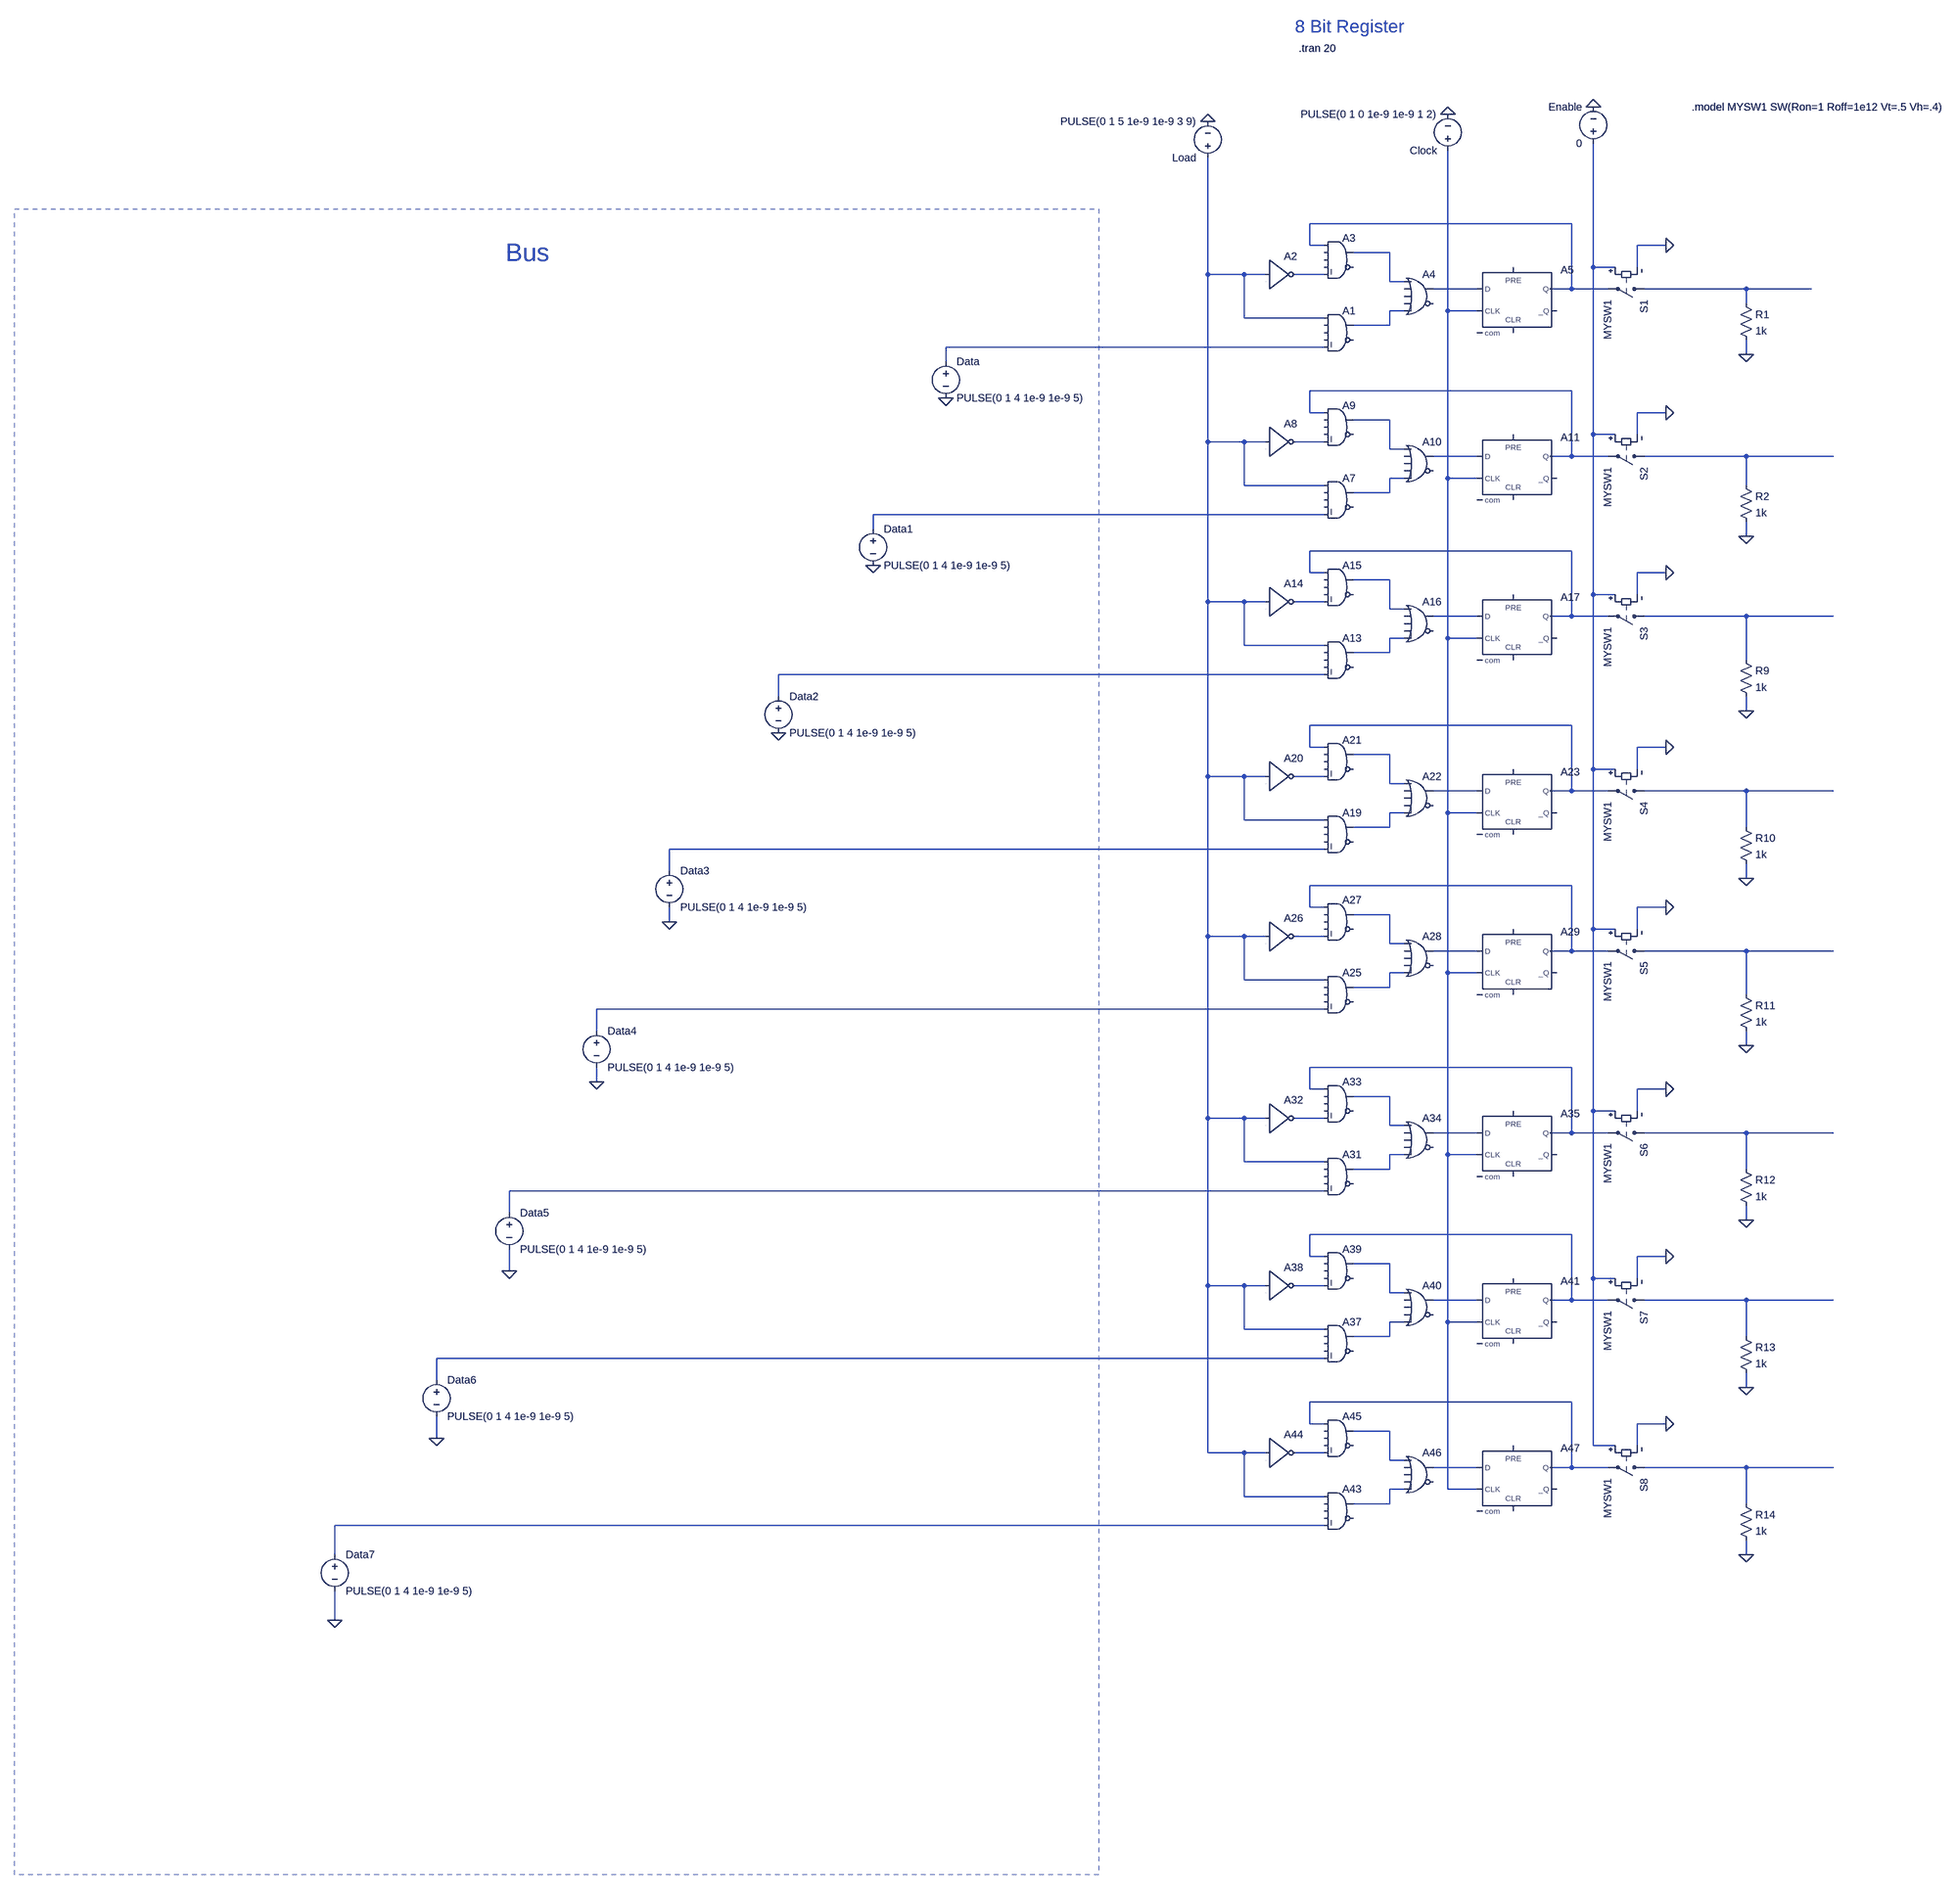
[diagram p0: schematic 8 Bit Register.asc]
8 Bit Register.asc, the LTspice schematic file:
Version 4
SHEET 1 3200 3668
WIRE 976 -176 400 -176
WIRE 400 -128 400 -176
WIRE 432 -128 400 -128
WIRE 1184 -128 1120 -128
WIRE 576 -112 496 -112
WIRE 1024 -80 1024 -576
WIRE 1072 -80 1024 -80
WIRE 1120 -80 1120 -128
WIRE 176 -64 176 -544
WIRE 256 -64 176 -64
WIRE 304 -64 256 -64
WIRE 432 -64 368 -64
WIRE 576 -48 576 -112
WIRE 608 -48 576 -48
WIRE 768 -32 672 -32
WIRE 976 -32 976 -176
WIRE 976 -32 928 -32
WIRE 1056 -32 976 -32
WIRE 1360 -32 1136 -32
WIRE 1504 -32 1360 -32
WIRE 1360 0 1360 -32
WIRE 608 16 576 16
WIRE 704 16 704 -560
WIRE 768 16 704 16
WIRE 256 32 256 -64
WIRE 432 32 256 32
WIRE 576 48 576 16
WIRE 576 48 496 48
WIRE 432 96 -400 96
WIRE 1360 112 1360 80
WIRE -400 128 -400 96
WIRE 976 192 400 192
WIRE 400 240 400 192
WIRE 432 240 400 240
WIRE 1184 240 1120 240
WIRE 576 256 496 256
WIRE 1024 288 1024 -80
WIRE 1072 288 1024 288
WIRE 1120 288 1120 240
WIRE 176 304 176 -64
WIRE 256 304 176 304
WIRE 304 304 256 304
WIRE 432 304 368 304
WIRE 576 320 576 256
WIRE 608 320 576 320
WIRE 768 336 672 336
WIRE 976 336 976 192
WIRE 976 336 928 336
WIRE 1056 336 976 336
WIRE 1360 336 1136 336
WIRE 1552 336 1360 336
WIRE 608 384 576 384
WIRE 704 384 704 16
WIRE 768 384 704 384
WIRE 256 400 256 304
WIRE 432 400 256 400
WIRE 1360 400 1360 336
WIRE 576 416 576 384
WIRE 576 416 496 416
WIRE 432 464 -560 464
WIRE -560 496 -560 464
WIRE 1360 512 1360 480
WIRE 976 544 400 544
WIRE 400 592 400 544
WIRE 432 592 400 592
WIRE 1184 592 1120 592
WIRE 576 608 496 608
WIRE 1024 640 1024 288
WIRE 1072 640 1024 640
WIRE 1120 640 1120 592
WIRE 176 656 176 304
WIRE 256 656 176 656
WIRE 304 656 256 656
WIRE 432 656 368 656
WIRE 576 672 576 608
WIRE 608 672 576 672
WIRE 768 688 672 688
WIRE 976 688 976 544
WIRE 976 688 928 688
WIRE 1056 688 976 688
WIRE 1360 688 1136 688
WIRE 1552 688 1360 688
WIRE 608 736 576 736
WIRE 704 736 704 384
WIRE 768 736 704 736
WIRE 256 752 256 656
WIRE 432 752 256 752
WIRE 576 768 576 736
WIRE 576 768 496 768
WIRE 1360 784 1360 688
WIRE 432 816 -768 816
WIRE -768 864 -768 816
WIRE 1360 896 1360 864
WIRE 976 928 400 928
WIRE 400 976 400 928
WIRE 432 976 400 976
WIRE 1184 976 1120 976
WIRE 576 992 496 992
WIRE 1024 1024 1024 640
WIRE 1072 1024 1024 1024
WIRE 1120 1024 1120 976
WIRE 176 1040 176 656
WIRE 256 1040 176 1040
WIRE 304 1040 256 1040
WIRE 432 1040 368 1040
WIRE 576 1056 576 992
WIRE 608 1056 576 1056
WIRE 768 1072 672 1072
WIRE 976 1072 976 928
WIRE 976 1072 928 1072
WIRE 1056 1072 976 1072
WIRE 1360 1072 1136 1072
WIRE 1552 1072 1360 1072
WIRE 608 1120 576 1120
WIRE 704 1120 704 736
WIRE 768 1120 704 1120
WIRE 256 1136 256 1040
WIRE 432 1136 256 1136
WIRE 576 1152 576 1120
WIRE 576 1152 496 1152
WIRE 1360 1152 1360 1072
WIRE 432 1200 -1008 1200
WIRE -1008 1248 -1008 1200
WIRE 1360 1264 1360 1232
WIRE 976 1280 400 1280
WIRE 400 1328 400 1280
WIRE 432 1328 400 1328
WIRE 1184 1328 1120 1328
WIRE 576 1344 496 1344
WIRE -1008 1360 -1008 1328
WIRE 1024 1376 1024 1024
WIRE 1072 1376 1024 1376
WIRE 1120 1376 1120 1328
WIRE 176 1392 176 1040
WIRE 256 1392 176 1392
WIRE 304 1392 256 1392
WIRE 432 1392 368 1392
WIRE 576 1408 576 1344
WIRE 608 1408 576 1408
WIRE 768 1424 672 1424
WIRE 976 1424 976 1280
WIRE 976 1424 928 1424
WIRE 1056 1424 976 1424
WIRE 1360 1424 1136 1424
WIRE 1552 1424 1360 1424
WIRE 608 1472 576 1472
WIRE 704 1472 704 1120
WIRE 768 1472 704 1472
WIRE 256 1488 256 1392
WIRE 432 1488 256 1488
WIRE 576 1504 576 1472
WIRE 576 1504 496 1504
WIRE 1360 1520 1360 1424
WIRE 432 1552 -1168 1552
WIRE -1168 1600 -1168 1552
WIRE 1360 1632 1360 1600
WIRE 976 1680 400 1680
WIRE -1168 1712 -1168 1680
WIRE 400 1728 400 1680
WIRE 432 1728 400 1728
WIRE 1184 1728 1120 1728
WIRE 576 1744 496 1744
WIRE 1024 1776 1024 1376
WIRE 1072 1776 1024 1776
WIRE 1120 1776 1120 1728
WIRE 176 1792 176 1392
WIRE 256 1792 176 1792
WIRE 304 1792 256 1792
WIRE 432 1792 368 1792
WIRE 576 1808 576 1744
WIRE 608 1808 576 1808
WIRE 768 1824 672 1824
WIRE 976 1824 976 1680
WIRE 976 1824 928 1824
WIRE 1056 1824 976 1824
WIRE 1360 1824 1136 1824
WIRE 1552 1824 1360 1824
WIRE 608 1872 576 1872
WIRE 704 1872 704 1472
WIRE 768 1872 704 1872
WIRE 256 1888 256 1792
WIRE 432 1888 256 1888
WIRE 576 1904 576 1872
WIRE 576 1904 496 1904
WIRE 1360 1904 1360 1824
WIRE 432 1952 -1360 1952
WIRE -1360 2000 -1360 1952
WIRE 1360 2016 1360 1984
WIRE 976 2048 400 2048
WIRE 400 2096 400 2048
WIRE 432 2096 400 2096
WIRE 1184 2096 1120 2096
WIRE 576 2112 496 2112
WIRE -1360 2128 -1360 2080
WIRE 1024 2144 1024 1776
WIRE 1072 2144 1024 2144
WIRE 1120 2144 1120 2096
WIRE 176 2160 176 1792
WIRE 256 2160 176 2160
WIRE 304 2160 256 2160
WIRE 432 2160 368 2160
WIRE 576 2176 576 2112
WIRE 608 2176 576 2176
WIRE 768 2192 672 2192
WIRE 976 2192 976 2048
WIRE 976 2192 928 2192
WIRE 1056 2192 976 2192
WIRE 1360 2192 1136 2192
WIRE 1552 2192 1360 2192
WIRE 608 2240 576 2240
WIRE 704 2240 704 1872
WIRE 768 2240 704 2240
WIRE 256 2256 256 2160
WIRE 432 2256 256 2256
WIRE 576 2272 576 2240
WIRE 576 2272 496 2272
WIRE 1360 2272 1360 2192
WIRE 432 2320 -1520 2320
WIRE -1520 2368 -1520 2320
WIRE 1360 2384 1360 2352
WIRE 976 2416 400 2416
WIRE 400 2464 400 2416
WIRE 432 2464 400 2464
WIRE 1184 2464 1120 2464
WIRE 576 2480 496 2480
WIRE -1520 2496 -1520 2448
WIRE 1024 2512 1024 2144
WIRE 1072 2512 1024 2512
WIRE 1120 2512 1120 2464
WIRE 176 2528 176 2160
WIRE 256 2528 176 2528
WIRE 304 2528 256 2528
WIRE 432 2528 368 2528
WIRE 576 2544 576 2480
WIRE 608 2544 576 2544
WIRE 768 2560 672 2560
WIRE 976 2560 976 2416
WIRE 976 2560 928 2560
WIRE 1056 2560 976 2560
WIRE 1360 2560 1136 2560
WIRE 1552 2560 1360 2560
WIRE 608 2608 576 2608
WIRE 704 2608 704 2240
WIRE 768 2608 704 2608
WIRE 256 2624 256 2528
WIRE 432 2624 256 2624
WIRE 576 2640 576 2608
WIRE 576 2640 496 2640
WIRE 1360 2640 1360 2560
WIRE 432 2688 -1744 2688
WIRE -1744 2752 -1744 2688
WIRE 1360 2752 1360 2720
WIRE -1744 2896 -1744 2832
FLAG -400 208 0
FLAG 704 -640 0
FLAG 176 -624 0
FLAG -560 576 0
FLAG -768 944 0
FLAG -1008 1360 0
FLAG -1168 1712 0
FLAG -1360 2128 0
FLAG -1520 2496 0
FLAG -1744 2896 0
FLAG 1184 -128 0
FLAG 1024 -656 0
FLAG 1184 240 0
FLAG 1184 592 0
FLAG 1184 976 0
FLAG 1184 1328 0
FLAG 1184 1728 0
FLAG 1184 2096 0
FLAG 1184 2464 0
FLAG 1360 112 0
FLAG 1360 512 0
FLAG 1360 896 0
FLAG 1360 1264 0
FLAG 1360 1632 0
FLAG 1360 2016 0
FLAG 1360 2384 0
FLAG 1360 2752 0
SYMBOL voltage -400 112 R0
WINDOW 123 0 0 Left 0
WINDOW 39 0 0 Left 0
SYMATTR InstName Data
SYMATTR Value PULSE(0 1 4 1e-9 1e-9 5)
SYMBOL voltage 176 -528 R180
WINDOW 123 0 0 Left 0
WINDOW 39 0 0 Left 0
SYMATTR InstName Load
SYMATTR Value PULSE(0 1 5 1e-9 1e-9 3 9)
SYMBOL Digital\\and 464 0 R0
SYMATTR InstName A1
SYMBOL Digital\\inv 304 -128 R0
SYMATTR InstName A2
SYMBOL Digital\\and 464 -160 R0
SYMATTR InstName A3
SYMBOL Digital\\or 640 -80 R0
SYMATTR InstName A4
SYMBOL Digital\\dflop 848 -80 R0
SYMATTR InstName A5
SYMBOL voltage 704 -544 R180
WINDOW 123 0 0 Left 0
WINDOW 39 0 0 Left 0
SYMATTR InstName Clock
SYMATTR Value PULSE(0 1 0 1e-9 1e-9 1 2)
SYMBOL Digital\\and 464 368 R0
SYMATTR InstName A7
SYMBOL Digital\\inv 304 240 R0
SYMATTR InstName A8
SYMBOL Digital\\and 464 208 R0
SYMATTR InstName A9
SYMBOL Digital\\or 640 288 R0
SYMATTR InstName A10
SYMBOL Digital\\dflop 848 288 R0
SYMATTR InstName A11
SYMBOL Digital\\and 464 720 R0
SYMATTR InstName A13
SYMBOL Digital\\inv 304 592 R0
SYMATTR InstName A14
SYMBOL Digital\\and 464 560 R0
SYMATTR InstName A15
SYMBOL Digital\\or 640 640 R0
SYMATTR InstName A16
SYMBOL Digital\\dflop 848 640 R0
SYMATTR InstName A17
SYMBOL Digital\\and 464 1104 R0
SYMATTR InstName A19
SYMBOL Digital\\inv 304 976 R0
SYMATTR InstName A20
SYMBOL Digital\\and 464 944 R0
SYMATTR InstName A21
SYMBOL Digital\\or 640 1024 R0
SYMATTR InstName A22
SYMBOL Digital\\dflop 848 1024 R0
SYMATTR InstName A23
SYMBOL Digital\\and 464 1456 R0
SYMATTR InstName A25
SYMBOL Digital\\inv 304 1328 R0
SYMATTR InstName A26
SYMBOL Digital\\and 464 1296 R0
SYMATTR InstName A27
SYMBOL Digital\\or 640 1376 R0
SYMATTR InstName A28
SYMBOL Digital\\dflop 848 1376 R0
SYMATTR InstName A29
SYMBOL Digital\\and 464 1856 R0
SYMATTR InstName A31
SYMBOL Digital\\inv 304 1728 R0
SYMATTR InstName A32
SYMBOL Digital\\and 464 1696 R0
SYMATTR InstName A33
SYMBOL Digital\\or 640 1776 R0
SYMATTR InstName A34
SYMBOL Digital\\dflop 848 1776 R0
SYMATTR InstName A35
SYMBOL Digital\\and 464 2224 R0
SYMATTR InstName A37
SYMBOL Digital\\inv 304 2096 R0
SYMATTR InstName A38
SYMBOL Digital\\and 464 2064 R0
SYMATTR InstName A39
SYMBOL Digital\\or 640 2144 R0
SYMATTR InstName A40
SYMBOL Digital\\dflop 848 2144 R0
SYMATTR InstName A41
SYMBOL Digital\\and 464 2592 R0
SYMATTR InstName A43
SYMBOL Digital\\inv 304 2464 R0
SYMATTR InstName A44
SYMBOL Digital\\and 464 2432 R0
SYMATTR InstName A45
SYMBOL Digital\\or 640 2512 R0
SYMATTR InstName A46
SYMBOL Digital\\dflop 848 2512 R0
SYMATTR InstName A47
SYMBOL voltage -560 480 R0
WINDOW 123 0 0 Left 0
WINDOW 39 0 0 Left 0
SYMATTR InstName Data1
SYMATTR Value PULSE(0 1 4 1e-9 1e-9 5)
SYMBOL voltage -768 848 R0
WINDOW 123 0 0 Left 0
WINDOW 39 0 0 Left 0
SYMATTR InstName Data2
SYMATTR Value PULSE(0 1 4 1e-9 1e-9 5)
SYMBOL voltage -1008 1232 R0
WINDOW 123 0 0 Left 0
WINDOW 39 0 0 Left 0
SYMATTR InstName Data3
SYMATTR Value PULSE(0 1 4 1e-9 1e-9 5)
SYMBOL voltage -1168 1584 R0
WINDOW 123 0 0 Left 0
WINDOW 39 0 0 Left 0
SYMATTR InstName Data4
SYMATTR Value PULSE(0 1 4 1e-9 1e-9 5)
SYMBOL voltage -1360 1984 R0
WINDOW 123 0 0 Left 0
WINDOW 39 0 0 Left 0
SYMATTR InstName Data5
SYMATTR Value PULSE(0 1 4 1e-9 1e-9 5)
SYMBOL voltage -1520 2352 R0
WINDOW 123 0 0 Left 0
WINDOW 39 0 0 Left 0
SYMATTR InstName Data6
SYMATTR Value PULSE(0 1 4 1e-9 1e-9 5)
SYMBOL voltage -1744 2736 R0
WINDOW 123 0 0 Left 0
WINDOW 39 0 0 Left 0
SYMATTR InstName Data7
SYMATTR Value PULSE(0 1 4 1e-9 1e-9 5)
SYMBOL voltage 1024 -560 R180
WINDOW 0 24 96 Left 2
WINDOW 3 24 16 Left 2
WINDOW 123 0 0 Left 0
WINDOW 39 0 0 Left 0
SYMATTR InstName Enable
SYMATTR Value 0
SYMBOL sw 1152 -32 R90
SYMATTR InstName S1
SYMATTR Value MYSW1
SYMBOL res 1344 -16 R0
SYMATTR InstName R1
SYMATTR Value 1k
SYMBOL sw 1152 336 R90
SYMATTR InstName S2
SYMATTR Value MYSW1
SYMBOL sw 1152 688 R90
SYMATTR InstName S3
SYMATTR Value MYSW1
SYMBOL sw 1152 1072 R90
SYMATTR InstName S4
SYMATTR Value MYSW1
SYMBOL sw 1152 1424 R90
SYMATTR InstName S5
SYMATTR Value MYSW1
SYMBOL sw 1152 1824 R90
SYMATTR InstName S6
SYMATTR Value MYSW1
SYMBOL sw 1152 2192 R90
SYMATTR InstName S7
SYMATTR Value MYSW1
SYMBOL sw 1152 2560 R90
SYMATTR InstName S8
SYMATTR Value MYSW1
SYMBOL res 1344 384 R0
SYMATTR InstName R2
SYMATTR Value 1k
SYMBOL res 1344 768 R0
SYMATTR InstName R9
SYMATTR Value 1k
SYMBOL res 1344 1136 R0
SYMATTR InstName R10
SYMATTR Value 1k
SYMBOL res 1344 1504 R0
SYMATTR InstName R11
SYMATTR Value 1k
SYMBOL res 1344 1888 R0
SYMATTR InstName R12
SYMATTR Value 1k
SYMBOL res 1344 2256 R0
SYMATTR InstName R13
SYMATTR Value 1k
SYMBOL res 1344 2624 R0
SYMATTR InstName R14
SYMATTR Value 1k
TEXT 376 -840 Left 2 !.tran 20
TEXT 368 -888 Left 4 ;8 Bit Register
TEXT -1368 -112 Left 5 ;Bus
TEXT 1240 -656 Left 2 !.model MYSW1 SW(Ron=1 Roff=1e12 Vt=.5 Vh=.4)
RECTANGLE Normal -64 3456 -2448 -208 1

The netlist it stands for:
* 8 Bit Register.asc
V§Data N010 0 PULSE(0 1 4 1e-9 1e-9 5)
V§Load N004 0 PULSE(0 1 5 1e-9 1e-9 3 9)
A1 N004 0 0 0 N010 0 N008 0 AND
A2 N004 0 0 0 0 N005 0 0 BUF
A3 N001 0 0 0 N005 0 N002 0 AND
A4 N002 0 0 0 N008 0 N006 0 OR
A5 N006 0 N009 0 0 0 N001 0 DFLOP
V§Clock N009 0 PULSE(0 1 0 1e-9 1e-9 1 2)
A7 N004 0 0 0 N017 0 N016 0 AND
A8 N004 0 0 0 0 N013 0 0 BUF
A9 N011 0 0 0 N013 0 N012 0 AND
A10 N012 0 0 0 N016 0 N014 0 OR
A11 N014 0 N009 0 0 0 N011 0 DFLOP
A13 N004 0 0 0 N024 0 N023 0 AND
A14 N004 0 0 0 0 N020 0 0 BUF
A15 N018 0 0 0 N020 0 N019 0 AND
A16 N019 0 0 0 N023 0 N021 0 OR
A17 N021 0 N009 0 0 0 N018 0 DFLOP
A19 N004 0 0 0 N031 0 N030 0 AND
A20 N004 0 0 0 0 N027 0 0 BUF
A21 N025 0 0 0 N027 0 N026 0 AND
A22 N026 0 0 0 N030 0 N028 0 OR
A23 N028 0 N009 0 0 0 N025 0 DFLOP
A25 N004 0 0 0 N038 0 N037 0 AND
A26 N004 0 0 0 0 N034 0 0 BUF
A27 N032 0 0 0 N034 0 N033 0 AND
A28 N033 0 0 0 N037 0 N035 0 OR
A29 N035 0 N009 0 0 0 N032 0 DFLOP
A31 N004 0 0 0 N045 0 N044 0 AND
A32 N004 0 0 0 0 N041 0 0 BUF
A33 N039 0 0 0 N041 0 N040 0 AND
A34 N040 0 0 0 N044 0 N042 0 OR
A35 N042 0 N009 0 0 0 N039 0 DFLOP
A37 N004 0 0 0 N052 0 N051 0 AND
A38 N004 0 0 0 0 N048 0 0 BUF
A39 N046 0 0 0 N048 0 N047 0 AND
A40 N047 0 0 0 N051 0 N049 0 OR
A41 N049 0 N009 0 0 0 N046 0 DFLOP
A43 N004 0 0 0 N059 0 N058 0 AND
A44 N004 0 0 0 0 N055 0 0 BUF
A45 N053 0 0 0 N055 0 N054 0 AND
A46 N054 0 0 0 N058 0 N056 0 OR
A47 N056 0 N009 0 0 0 N053 0 DFLOP
V§Data1 N017 0 PULSE(0 1 4 1e-9 1e-9 5)
V§Data2 N024 0 PULSE(0 1 4 1e-9 1e-9 5)
V§Data3 N031 0 PULSE(0 1 4 1e-9 1e-9 5)
V§Data4 N038 0 PULSE(0 1 4 1e-9 1e-9 5)
V§Data5 N045 0 PULSE(0 1 4 1e-9 1e-9 5)
V§Data6 N052 0 PULSE(0 1 4 1e-9 1e-9 5)
V§Data7 N059 0 PULSE(0 1 4 1e-9 1e-9 5)
V§Enable N003 0 0
S1 N007 N001 N003 0 MYSW1
R1 N007 0 1k
S2 N015 N011 N003 0 MYSW1
S3 N022 N018 N003 0 MYSW1
S4 N029 N025 N003 0 MYSW1
S5 N036 N032 N003 0 MYSW1
S6 N043 N039 N003 0 MYSW1
S7 N050 N046 N003 0 MYSW1
S8 N057 N053 N003 0 MYSW1
R2 N015 0 1k
R9 N022 0 1k
R10 N029 0 1k
R11 N036 0 1k
R12 N043 0 1k
R13 N050 0 1k
R14 N057 0 1k
.tran 20
* 8 Bit Register
* Bus
.model MYSW1 SW(Ron=1 Roff=1e12 Vt=.5 Vh=.4)
.backanno
.end